# Altium schematic sheet TDII_ANALOG_R00.SchDoc
size A4
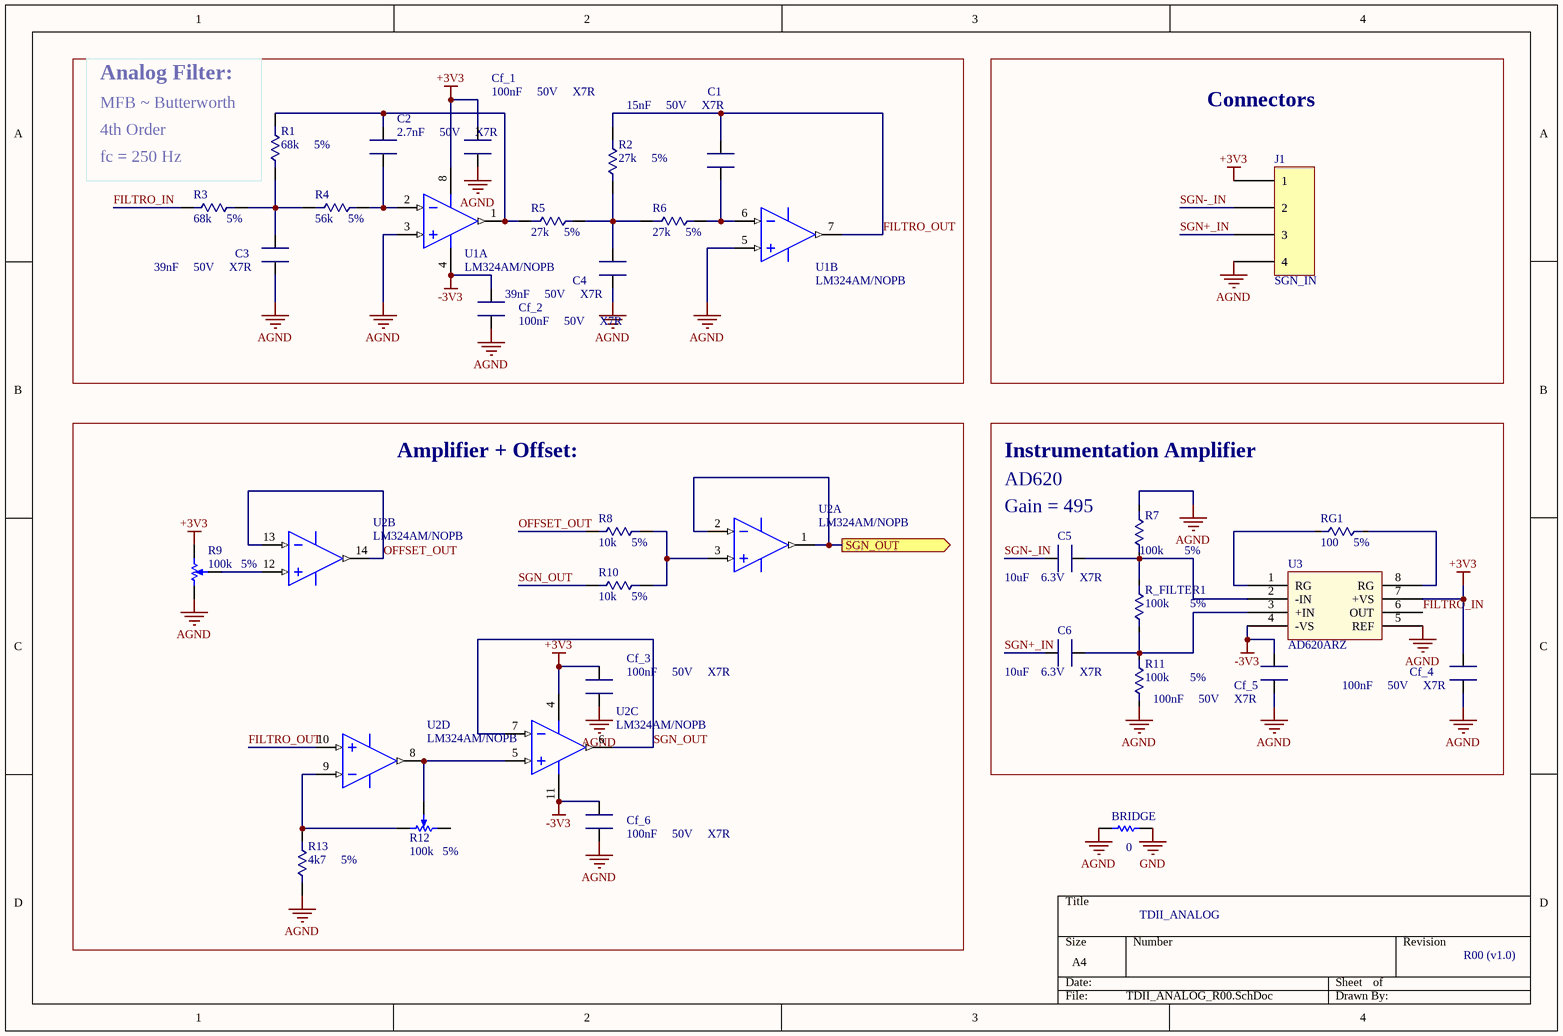
[diagram p0: TDII_ANALOG_R00.SchDoc]

## Parts
BRIDGE  value 0  [R_0805]  (hidden comment: Res1)
C1  15nF     50V     X7R  [C_0805]
C2  2.7nF     50V     X7R  [C_0805]
C3  39nF     50V     X7R  [C_0805]
C4  39nF     50V     X7R  [C_0805]
C5  10uF    6.3V     X7R  [C_0805]
C6  10uF    6.3V     X7R  [C_0805]
Cf_1  100nF     50V     X7R  [C_0805]
Cf_2  100nF     50V     X7R  [C_0805]
Cf_3  100nF     50V     X7R  [C_0805]
Cf_4  100nF     50V     X7R  [C_0805]
Cf_5  100nF     50V     X7R  [C_0805]
Cf_6  100nF     50V     X7R  [C_0805]
J1  SGN_IN  [HEADER_1X4]
R1  68k     5%  [R_0805]
R2  27k     5%  [R_0805]
R3  68k     5%  [R_0805]
R4  56k     5%  [R_0805]
R5  27k     5%  [R_0805]
R6  27k     5%  [R_0805]
R7  100k       5%  [R_0805]
R8  10k     5%  [R_0805]
R9  100k   5%  [Preset]
R10  10k     5%  [R_0805]
R11  100k       5%  [R_0805]
R12  100k   5%  [Preset]
R13  4k7     5%  [R_0805]
R_FILTER1  100k       5%  [R_0805]
RG1  100     5%  [R_0805]
U1  LM324AM/NOPB  [SOI8]  (parts A,B of 2)
U2  LM324AM/NOPB  [SOIC14]  (parts A,B,C,D of 4)
U3  AD620ARZ  [SOI8]

## Blocks framed on the sheet
Analog Filter:: C1-C4 Cf_1 Cf_2 R1-R6 U1
Connectors: J1
Amplifier + Offset:: Cf_3 Cf_6 R8-R10 R12 R13 U2
Instrumentation Amplifier: C5 C6 Cf_4 Cf_5 R7 R11 R_FILTER1 RG1 U3

## Ports
SGN_OUT (out)

## Nets
+3V3: Cf_1.2 Cf_3.2 Cf_4.2 J1.1 R9.2 U1.8(V+) U2.4(V+) U3.7(+VS)
-3V3: Cf_2.2 Cf_5.1 Cf_6.2 U1.4(GND) U2.11(GND) U3.4(-VS)
AGND: BRIDGE.1 C3.1 C4.1 Cf_1.1 Cf_2.1 Cf_3.1 Cf_4.1 Cf_5.2 Cf_6.1 J1.4 R7.2 R9.1 R11.1 R13.1 U1.3(INA+) U1.5(INB+) U3.5(REF)
GND: BRIDGE.2
FILTRO_IN: R3.1 U3.6(OUT)
FILTRO_OUT: C1.2 R2.2 U1.7(OUTB) U2.10(IN3+)
OFFSET_OUT: R8.1 U2.13(IN4-) U2.14(OUT4)
SGN+_IN: C6.1 J1.3
SGN-_IN: C5.1 J1.2
SGN_OUT: R10.1 U2.6(IN2-) U2.7(OUT2)
SGN_OUT: U2.1(OUT1) U2.2(IN1-) ; port SGN_OUT  [a separate net that carries the same name]
NetC1_1: C1.1 R6.1 U1.6(INB-)
NetC2_1: C2.1 R4.1 U1.2(INA-)
NetC2_2: C2.2 R1.2 R5.2 U1.1(OUTA)
NetC3_2: C3.2 R1.1 R3.2 R4.2
NetC4_2: C4.2 R2.1 R5.1 R6.2
NetC5_2: C5.2 R7.1 R_FILTER1.2 U3.2(-IN)
NetC6_2: C6.2 R11.2 R_FILTER1.1 U3.3(+IN)
NetR8_2: R8.2 R10.2 U2.3(IN1+)
NetR9_3: R9.3 U2.12(IN4+)
NetR12_1: R12.1 R13.2 U2.9(IN3-)
NetR12_3: R12.3 U2.5(IN2+) U2.8(OUT3)
NetRG1_1: RG1.1 U3.1(RG)
NetRG1_2: RG1.2 U3.8(RG)

Not connected (* = marked no-connect by the designer): R12 2

## Notes on the sheet
- (near R1) MFB ~ Butterworth
- 4th Order
- (near R3) fc = 250 Hz
- Gain = 495
- AD620
- TDII_ANALOG
- R00 (v1.0)

## Library data of the parts
BRIDGE = Res1: Resistor; Published: 8-Jun-2000; LatestRevisionDate: 17-Jul-2002; LatestRevisionNote: Re-released for DXP Platform.; PackageReference: AXIAL-0.3; Publisher: Altium Limited
C1-C6 Cf_1-Cf_6 = CAP
J1 = Conector_4 ( 0.100")
R1-R8 R10 R11 R13 R_FILTER1 RG1 = RES
R9 R12 = RPot SM: Square Trimming Potentiometer; Published: 17-Dec-2003; DatasheetVersion: Oct-2003; PackageReference: POT4MM-2; Publisher: Altium Limited; ComponentLink1Description: Manufacturer Link; ComponentLink1URL: http://bourns.com/2/search.html
U1 = LM358M: Low Power Dual Operational Amplifier, 8-pin Narrow SOIC; Manufacturer: National Semiconductor; PackageTopMarking: NSZXTT*LM*358M; PowerWise: N; CompType: Amplifiers; High-Reliability: Y; DatasheetVersion: Oct-2005; PackageVersion: revM, May-2009; PackageReference: M08A; PackageDescription: SOIC Narrow, 4.9 x 3.9 x 1.45mm, 8 Lead, 1.27mm Pitch; PartNumber: LM358M; RoHS: N; PinCount: 8; Code_JEDEC: MS-012-AA; Code_IPC: SOIC127P600-8; ComponentLink1Description: Manufacturer URL; ComponentLink1URL: http://www.national.com/; ComponentLink2Description: LM358 Datasheet; ComponentLink2URL: http://www.national.com/ds/LM/LM358.pdf; ComponentLink3Description: LM358 Web Page; ComponentLink3URL: http://www.national.com/pf/LM/LM358.html; ComponentLink4Description: M08A Package Page; ComponentLink4URL: http://www.national.com/packaging/folders/m08a.html; Digi-Key Part Number: LM358MXFSCT-ND
U2 = LM324M: Low Power Quad Operational Amplifier, 14-pin Narrow SOIC; Manufacturer: National Semiconductor; PackageTopMarking: NSUZXYTTE#*LM324M; PowerWise: N; CompType: Amplifiers; High-Reliability: Y; DatasheetVersion: Aug-2000; PackageVersion: revJ, Jan-1996; PackageReference: M14A; PackageDescription: Molded Package S.O., .150in Wide, 14 Lead; PartNumber: LM324M; RoHS: N; PinCount: 14; Code_JEDEC: MS-012AB; Code_IPC: SOIC127P600-14; ComponentLink1Description: Manufacturer URL; ComponentLink1URL: http://www.national.com/; ComponentLink2Description: LM324 Datasheet; ComponentLink2URL: http://www.national.com/ds/LM/LM324.pdf; ComponentLink3Description: LM324 Web Page; ComponentLink3URL: http://www.national.com/pf/LM/LM324.html; ComponentLink4Description: M14A Package Page; ComponentLink4URL: http://www.national.com/packaging/folders/m14a.html
U3 = AD620: Digi-Key Part Number: AD620ARZ-REEL7TR-ND